# EAGLE design Power_Distribution_Board (EAGLE 5.11)
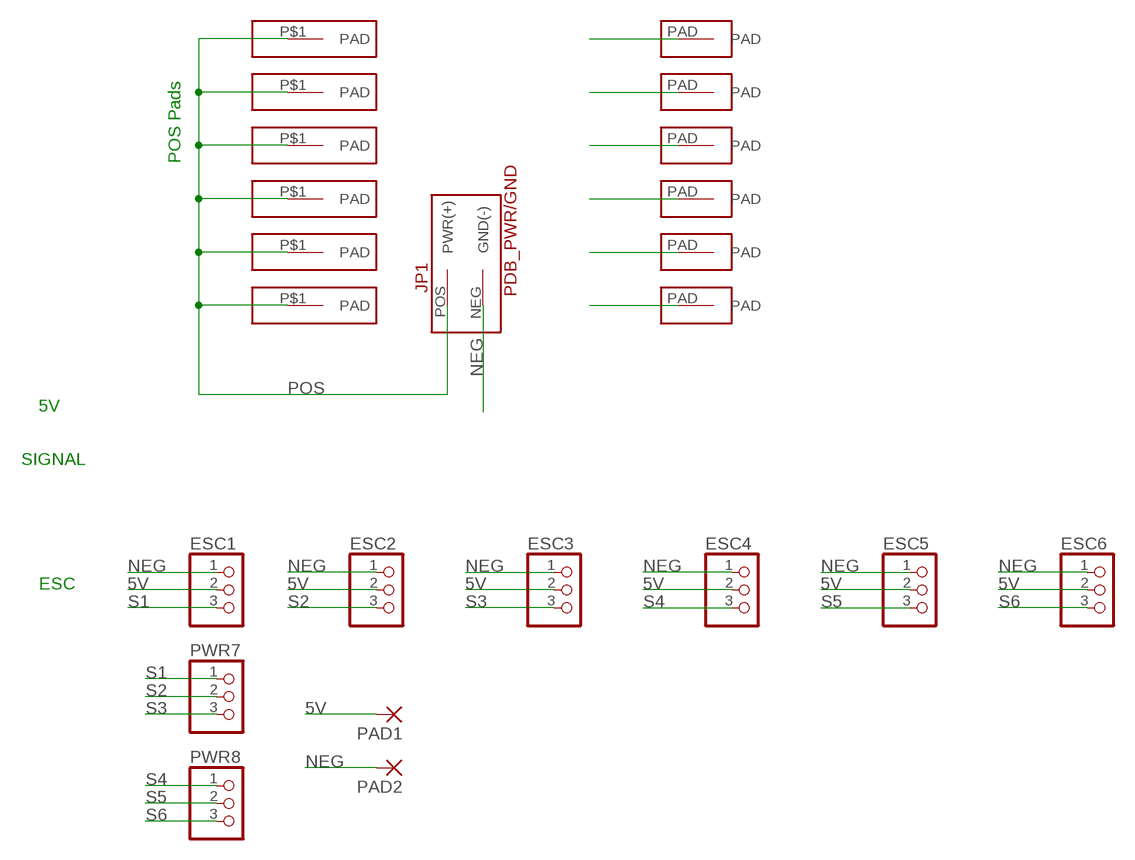
[diagram p0: schematic, sheet 1]

## Parts
BAT  DEANPAD_BSTOP  [DEANPAD_BSTOP]
ESC1  PINHD-1X3  [1X03]
ESC2  PINHD-1X3  [1X03]
ESC3  PINHD-1X3  [1X03]
ESC4  PINHD-1X3  [1X03]
ESC5  PINHD-1X3  [1X03]
ESC6  PINHD-1X3  [1X03]
JP1  PDB_PWR/GND  [PDB_PWR/GND]
PAD1  1,6/0,8  [1,6/0,8]
PAD2  1,6/0,8  [1,6/0,8]
PWR7  PINHD-1X3  [1X03]
PWR8  PINHD-1X3  [1X03]
U$1  DEANPAD  [DEANPAD]
U$2  DEANPAD  [DEANPAD]
U$3  DEANPAD  [DEANPAD]
U$4  DEANPAD  [DEANPAD]
U$5  DEANPAD_BSTOP  [DEANPAD_BSTOP]
U$6  DEANPAD  [DEANPAD]
U$7  DEANPAD_BSTOP  [DEANPAD_BSTOP]
U$8  DEANPAD_BSTOP  [DEANPAD_BSTOP]
U$9  DEANPAD  [DEANPAD]
U$10  DEANPAD_BSTOP  [DEANPAD_BSTOP]
U$11  DEANPAD_BSTOP  [DEANPAD_BSTOP]

## Nets
5V: ESC1.2 ESC2.2 ESC3.2 ESC4.2 ESC5.2 ESC6.2 PAD1.1(P)
NEG: ESC1.1 ESC2.1 ESC3.1 ESC4.1 ESC5.1 ESC6.1 JP1.NEG(GND(-)) PAD2.1(P) U$1.PAD U$2.PAD U$3.PAD U$4.PAD U$6.PAD U$9.PAD
POS: BAT.P$1(PAD) JP1.POS(PWR(+)) U$5.P$1(PAD) U$7.P$1(PAD) U$8.P$1(PAD) U$10.P$1(PAD) U$11.P$1(PAD)
S1: ESC1.3 PWR7.1
S2: ESC2.3 PWR7.2
S3: ESC3.3 PWR7.3
S4: ESC4.3 PWR8.1
S5: ESC5.3 PWR8.2
S6: ESC6.3 PWR8.3

## Notes on the sheet
- POS Pads
- 5V
- SIGNAL
- ESC

## Library data of the parts
BAT U$5 U$7 U$8 U$10 U$11 = alansanchez:DEANPAD_BSTOP
ESC1-ESC6 PWR7 PWR8 = adafruit:PINHD-1X3: PIN HEADER
JP1 = alansanchez:PDB_PWR/GND
PAD1 PAD2 = wirepad:1,6/0,8: THROUGH-HOLE PAD
U$1-U$4 U$6 U$9 = alansanchez:DEANPAD

## Board
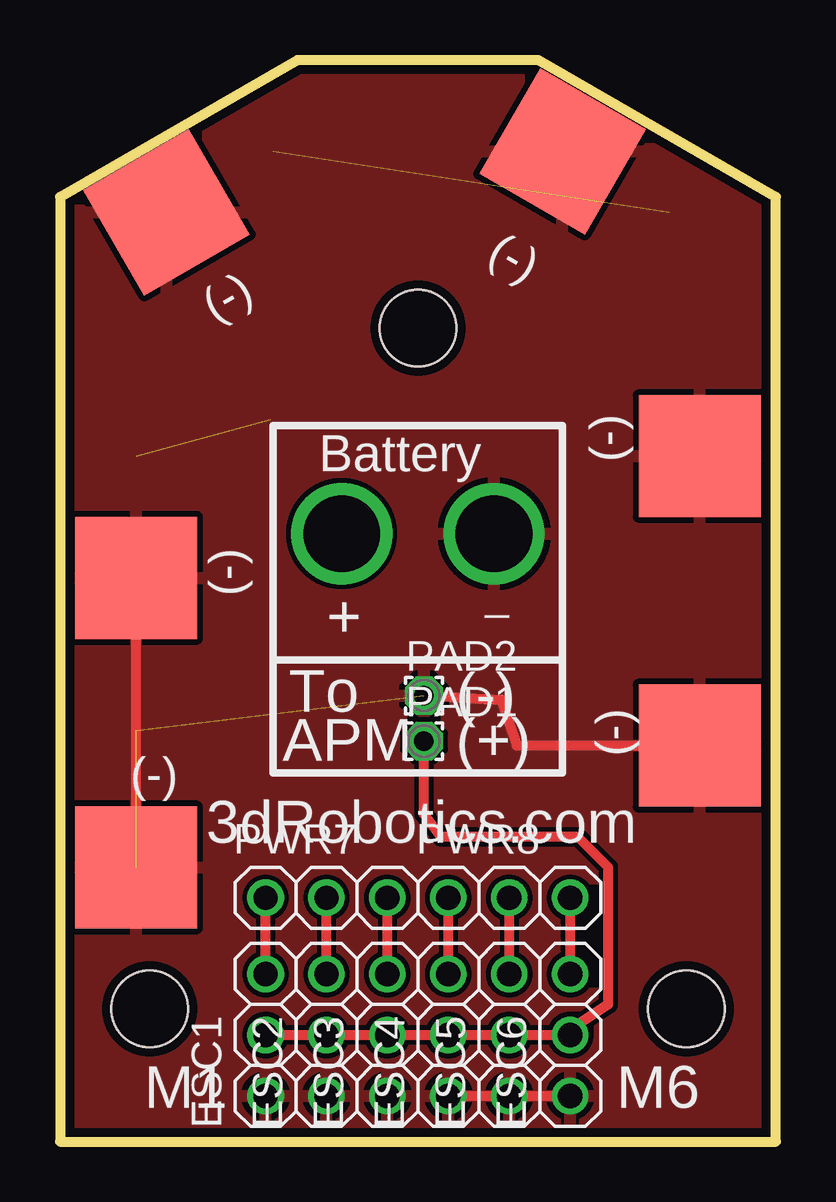
[diagram p1: board, top side]
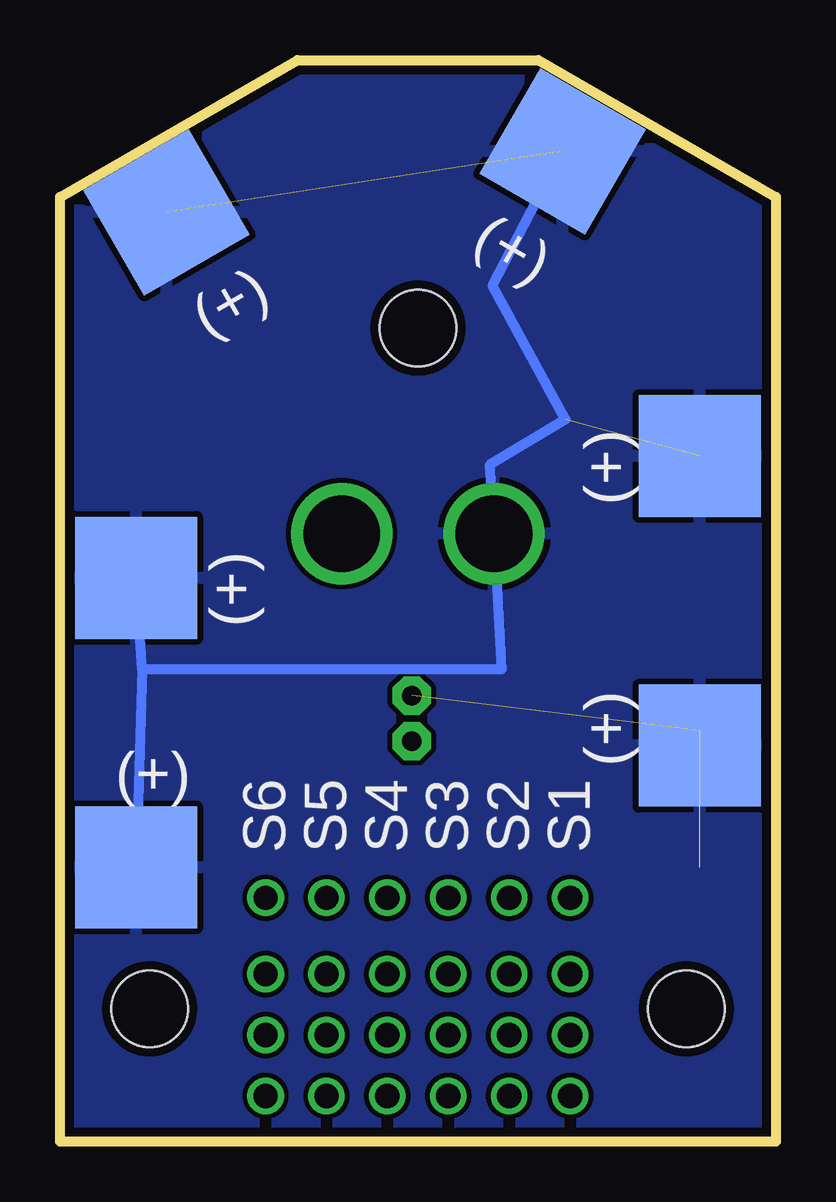
[diagram p2: board, bottom side, seen from below]

Size 29.84 x 45.09 mm. Coordinates in mm from the lower left corner, seen from the top.
Outline: 0,0 29.84,0 29.84,39.37 19.95,45.09 9.9,45.09 0,39.37 0,0
Copper layers (1*16): Top 0.035mm / dielectric 1.5mm / Bottom 0.035mm
Design rules "default *": minimum track width 10mil, minimum drill 24mil, track to track 8mil, track to pad 8mil, pad to pad 8mil, via to via 8mil, smd to smd 8mil, copper to edge 15mil, drill to drill 8mil, minimum pad ring 10mil, minimum via ring 8mil, stop-mask expansion 4mil, vias tented up to drill 0mil, thermal gap 10mil
Holes 3.2 mm at 3.73,5.54 26.11,5.54 14.92,33.91

### Footprints (pad centres in the part's own frame; a part is rotated, then mirrored left to right if it is on the bottom)
DEANPAD_BSTOP = smd 5.08 x 5.08 bottom: P$1 0,0
1X03 = drill 1.016 round: 1 -2.54,0; 2 0,0; 3 2.54,0
PDB_PWR/GND = drill 3.2 round: NEG 2.54,2.54; POS -3.81,2.54
1,6/0,8 = drill 0.813 pad 1.6 octagon: 1 0,0
DEANPAD = smd 5.08 x 5.08: PAD 0,0

### Placement (x,y rotation side)
BAT  3.17,16.51 0 top
ESC1  8.57,4.45 90 top
ESC2  11.11,4.45 90 top
ESC3  13.65,4.45 90 top
ESC4  16.19,4.45 90 top
ESC5  18.73,4.45 90 top
ESC6  21.27,4.45 90 top
JP1  15.56,22.8 0 top
PAD1  15.18,16.69 0 top
PAD2  15.18,18.59 0 top
PWR7  11.11,10.16 0 top
PWR8  18.73,10.16 0 top
U$1  26.67,28.57 90 top
U$2  3.17,11.43 0 top
U$3  26.67,16.51 270 top
U$4  3.17,23.49 180 top
U$5  26.67,23.49 90 top
U$6  4.45,38.73 210 top
U$7  3.17,28.57 180 top
U$8  26.67,11.43 270 top
U$9  20.95,41.27 60 top
U$10  8.89,41.27 210 top
U$11  25.4,38.73 60 top

### Tracks (layer width: path | path; a pad name or v marks a point on that pad's centre or on a via)
5V
  Top 0.406: PAD1.1 15.18,13.65 15.88,12.7 21.59,12.7 22.86,11.43 22.86,5.71 20.95,4.45 ESC6.2 ESC5.2 ESC4.2 ESC3.2 ESC2.2 ESC1.2
NEG  (2 unrouted)
  Top 0.406: ESC6.1 ESC5.1 ESC4.1 | U$2.PAD U$4.PAD | U$3.PAD 19.05,16.51 18.41,18.41 PAD2.1
  pour Top: 0,0 29.84,0 29.84,39.37 19.95,45.09 9.9,45.09 0,39.37
POS  (2 unrouted)
  Bottom 0.406: 26.42,19.68 U$8.P$1 | U$10.P$1 11.81,35.69 8.76,30.1 11.94,28.19 JP1.POS 11.43,19.68 26.42,19.68 | 26.42,19.68 U$5.P$1
  pour Bottom: 0,0 29.84,0 29.84,39.37 19.95,45.09 9.9,45.09 0,39.37
S1
  Top 0.406: ESC1.3 PWR7.1
S2
  Top 0.406: ESC2.3 PWR7.2
S3
  Top 0.406: ESC3.3 PWR7.3
S4
  Top 0.406: ESC4.3 PWR8.1
S5
  Top 0.406: ESC5.3 PWR8.2
S6
  Top 0.406: ESC6.3 PWR8.3

### Text on the board
tPlace: (-) | (-) | (-) | Battery | (-) | To | (-) | (-) | (-) | APM | (+) | 3dRobotics.com | M1 | M6
bPlace: (+) | (+) | (+) | (+) | (+) | (+) | S1 | S2 | S3 | S4 | S5 | S6